# Altium schematic sheet Sheet1.SCHDOC
size 593 x 439 mm; ApprovedBy: ГрибановСВ; CheckedBy: КычкинАВ; Author: СергеевДС; DocumentNumber: ЕМС.02.00.200 Э3; SheetNumber: 1; SheetTotal: 4; DocumentName: Sheet1.SCHDOC
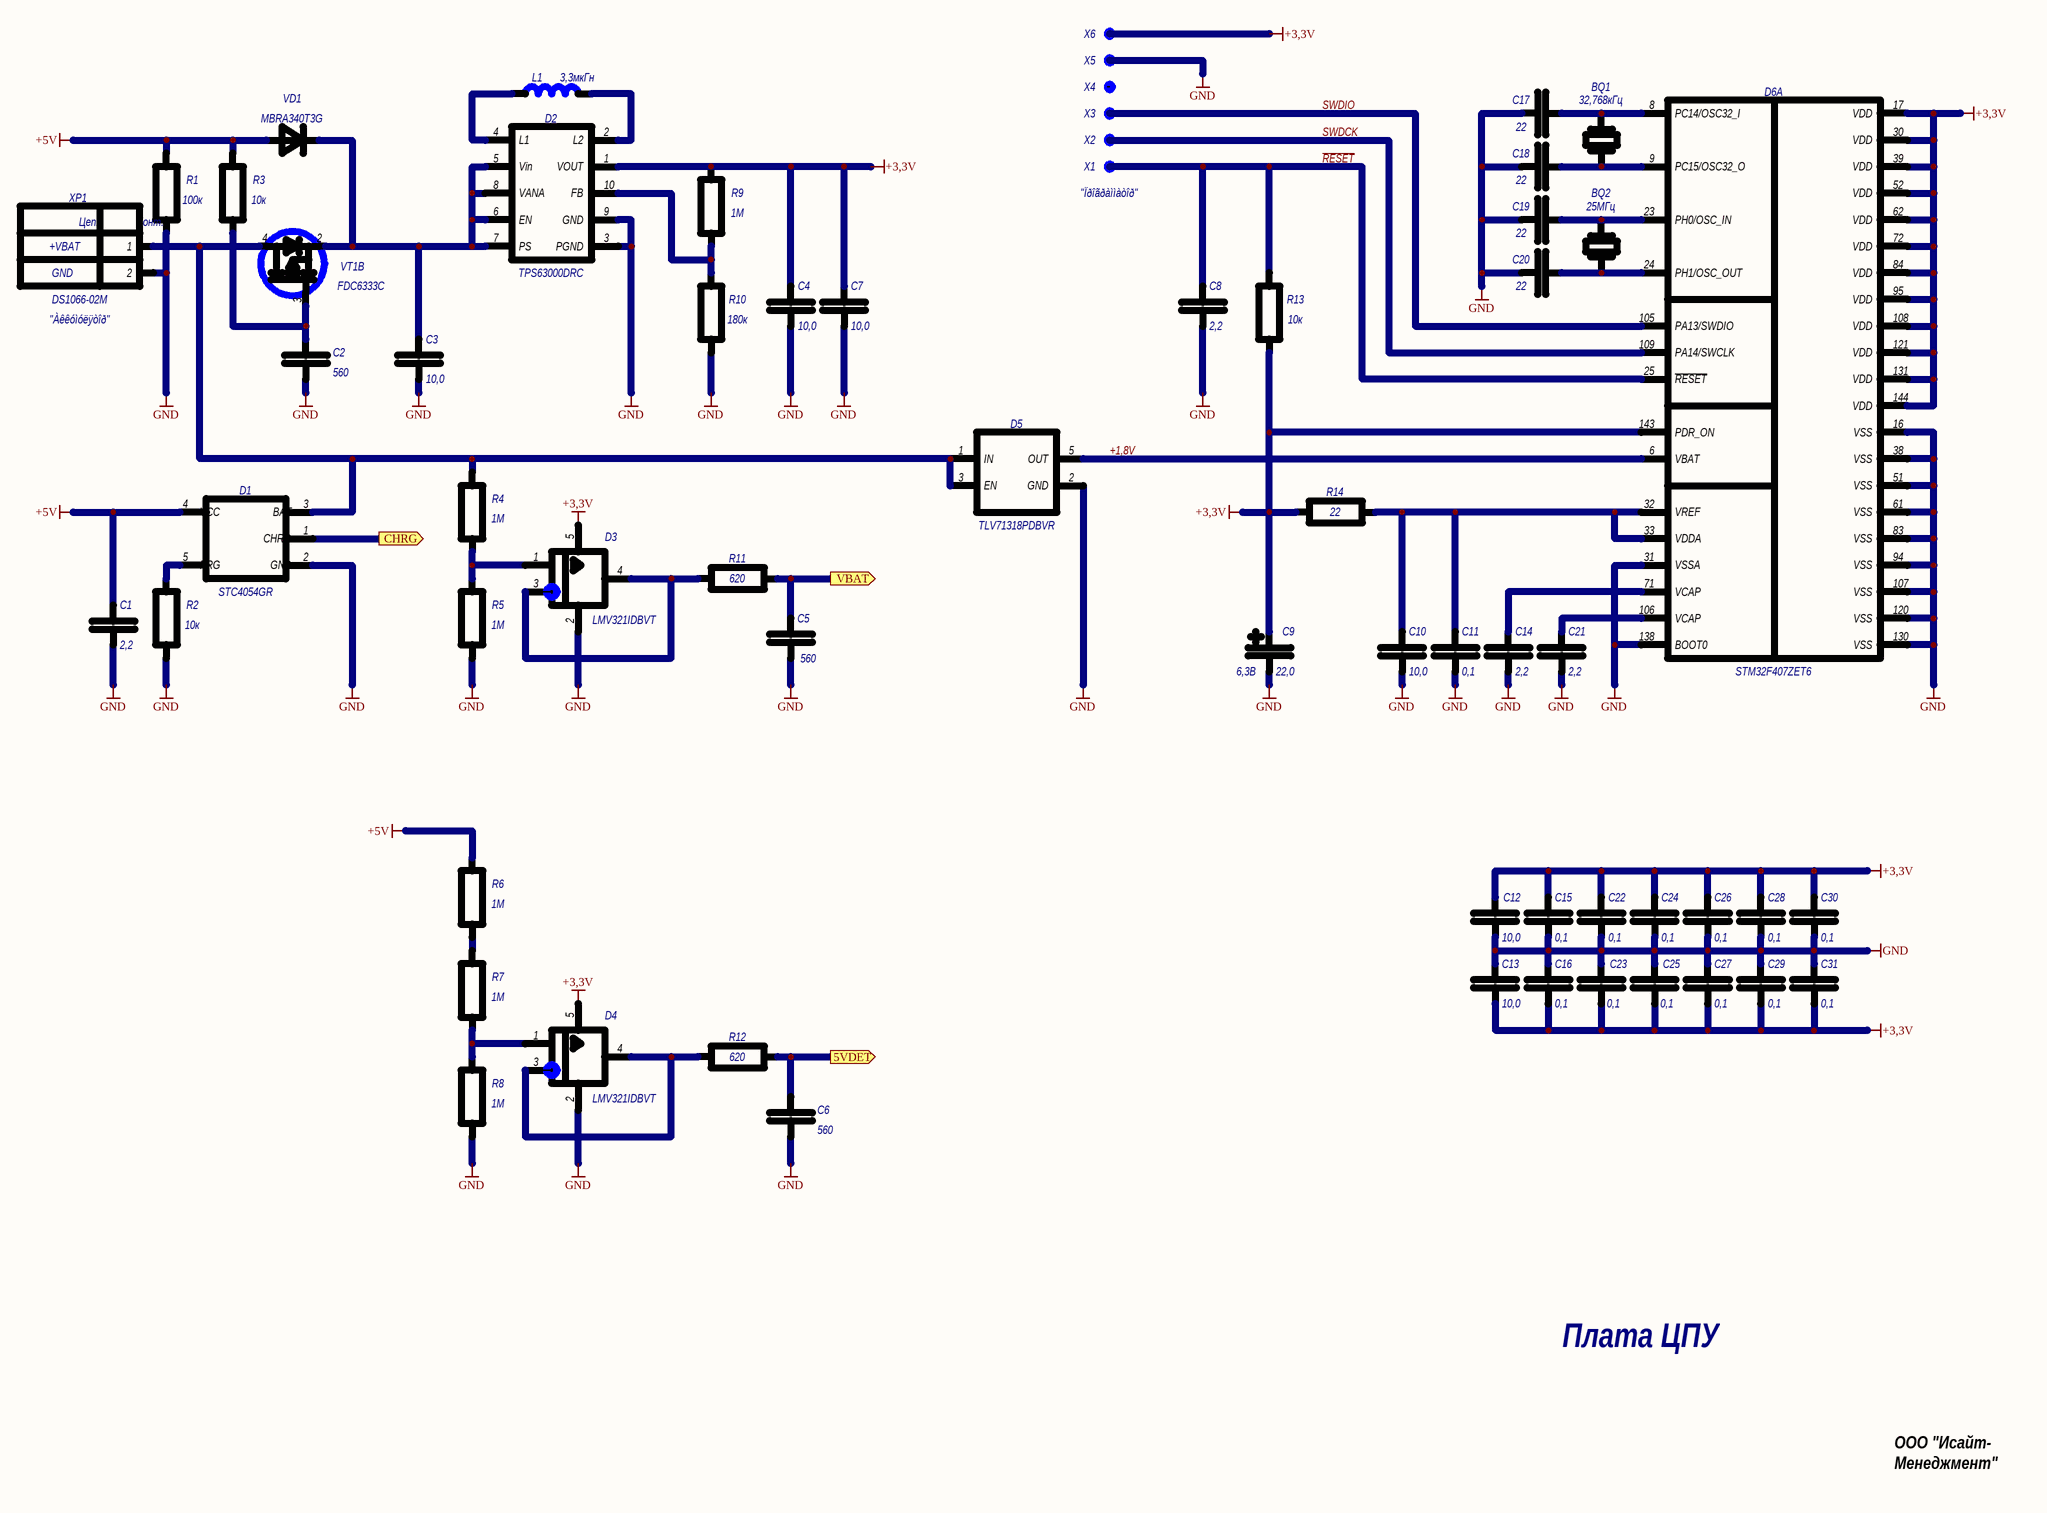
[diagram p0: Sheet1.SCHDOC]

## Parts
BQ1  DT38-32K768  [DT38]  (value not drawn)
BQ2  HC49U-06M  [HC49U]  (value not drawn)
C1  value 2,2  [0805]  (hidden comment: К0805)
C2  value 560  [0805]  (hidden comment: К0805)
C3  value 10,0  [0805]  (hidden comment: К0805)
C4  value 10,0  [0805]  (hidden comment: К0805)
C5  value 560  [0805]  (hidden comment: К0805)
C6  value 560  [0805]  (hidden comment: К0805)
C7  value 10,0  [0805]  (hidden comment: К0805)
C8  value 2,2  [0805]  (hidden comment: К0805)
C9  value 22,0  TG: 6,3В  [TANTAL]  (hidden comment: КТ)
C10  value 10,0  [0805]  (hidden comment: К0805)
C11  value 0,1  [0805]  (hidden comment: К0805)
C12  value 10,0  [0805]  (hidden comment: К0805)
C13  value 10,0  [0805]  (hidden comment: К0805)
C14  value 2,2  [0805]  (hidden comment: К0805)
C15  value 0,1  [0805]  (hidden comment: К0805)
C16  value 0,1  [0805]  (hidden comment: К0805)
C17  value 22  [0805]  (hidden comment: К0805)
C18  value 22  [0805]  (hidden comment: К0805)
C19  value 22  [0805]  (hidden comment: К0805)
C20  value 22  [0805]  (hidden comment: К0805)
C21  value 2,2  [0805]  (hidden comment: К0805)
C22  value 0,1  [0805]  (hidden comment: К0805)
C23  value 0,1  [0805]  (hidden comment: К0805)
C24  value 0,1  [0805]  (hidden comment: К0805)
C25  value 0,1  [0805]  (hidden comment: К0805)
C26  value 0,1  [0805]  (hidden comment: К0805)
C27  value 0,1  [0805]  (hidden comment: К0805)
C28  value 0,1  [0805]  (hidden comment: К0805)
C29  value 0,1  [0805]  (hidden comment: К0805)
C30  value 0,1  [0805]  (hidden comment: К0805)
C31  value 0,1  [0805]  (hidden comment: К0805)
D1  STC4054GR  [SOT-23-5]
D2  TPS63000DRC  [VSON-10]
D3  LMV321IDBVT  [SOT-23-5]
D4  LMV321IDBVT  [SOT-23-5]
D5  TLV71318PDBVR  [SOT-23-5]
D6  STM32F407ZET6  [LQFP-144]  (part A of 4)
L1  SRN3015-101M  [SRN3015]  (value not drawn)
R1  Р0805  [0805]  (value not drawn)
R2  Р0805  [0805]  (value not drawn)
R3  Р0805  [0805]  (value not drawn)
R4  value 1M  [0805]  (hidden comment: Р0805)
R5  value 1M  [0805]  (hidden comment: Р0805)
R6  value 1M  [0805]  (hidden comment: Р0805)
R7  value 1M  [0805]  (hidden comment: Р0805)
R8  value 1M  [0805]  (hidden comment: Р0805)
R9  value 1M  [0805]  (hidden comment: Р0805)
R10  Р0805  [0805]  (value not drawn)
R11  value 620  [0805]  (hidden comment: Р0805)
R12  value 620  [0805]  (hidden comment: Р0805)
R13  Р0805  [0805]  (value not drawn)
R14  value 22  [0805]  (hidden comment: Р0805)
VD1  MBRA340T3G  [SMA]
VT1  FDC6333C  [SOT-23-6]  (part B of 2)
X1  X  [01]  (value not drawn)
X2  X  [01]  (value not drawn)
X3  X  [01]  (value not drawn)
X4  X  [01]  (value not drawn)
X5  X  [01]  (value not drawn)
X6  X  [01]  (value not drawn)
XP1  DS1066-02M  2: GND  1: +VBAT  [DS1066-02M]

## Ports
5VDET (out), CHRG (out), VBAT (out)

## Nets
+3,3V: C4.2 C7.2 C9.1(Plus) C12.1 C13.1 C15.2 C16.1 C22.2 C23.2 C24.2 C25.2 C26.2 C27.1 C28.2 C29.1 C30.2 C31.1 D2.1(VOUT) D3.5(V) D4.5(V) D6.17(VDD) D6.30(VDD) D6.39(VDD) D6.52(VDD) D6.62(VDD) D6.72(VDD) D6.84(VDD) D6.95(VDD) D6.108(VDD) D6.121(VDD) D6.131(VDD) D6.143(PDR_ON) D6.144(VDD) R9.2 R13.1 R14.2 X6.1
+5V: C1.2 D1.4(VCC) R1.2 R3.2 R6.2 VD1.A(Anod)
GND: C1.1 C2.1 C3.1 C4.1 C5.2 C6.1 C7.1 C8.1 C9.2(Minus) C10.1 C11.1 C12.2 C13.2 C14.1 C15.1 C16.2 C17.2 C18.2 C19.2 C20.2 C21.1 C22.1 C23.1 C24.1 C25.1 C26.1 C27.2 C28.1 C29.2 C30.1 C31.2 D1.2(GND) D2.3(PGND) D2.9(GND) D2.11(GND) D3.2(G) D4.2(G) D5.2(GND) D6.16(VSS) D6.31(VSSA) D6.38(VSS) D6.51(VSS) D6.61(VSS) D6.83(VSS) D6.94(VSS) D6.107(VSS) D6.120(VSS) D6.130(VSS) D6.138(BOOT0) R1.1 R2.1 R5.1 R8.1 R10.1 X5.1 XP1.2
5VDET: C6.2 R12.1 ; port 5VDET
+1,8V: D5.5(OUT) D6.6(VBAT)
CHRG: D1.1(CHRG) ; port CHRG
~{RESET}: C8.2 D6.25(~{RESET}) R13.2 X1.1
SWDCK: D6.109(PA14/SWCLK) X2.1
SWDIO: D6.105(PA13/SWDIO) X3.1
VBAT: C5.1 R11.1 ; port VBAT
NetBQ1_1: BQ1.1 C18.1 D6.9(PC15/OSC32_O)
NetBQ1_2: BQ1.2 C17.1 D6.8(PC14/OSC32_I)
NetBQ2_1: BQ2.1 C20.1 D6.24(PH1/OSC_OUT)
NetBQ2_2: BQ2.2 C19.1 D6.23(PH0/OSC_IN)
NetC2_2: C2.2 R3.1 VT1.3(Gate)
NetC3_2: C3.2 D2.5(Vin) D2.6(EN) D2.7(PS) D2.8(VANA) VD1.K(Katod) VT1.2(Source)
NetC10_2: C10.2 C11.2 D6.32(VREF) D6.33(VDDA) R14.1
NetC14_2: C14.2 D6.71(VCAP)
NetC21_2: C21.2 D6.106(VCAP)
NetD1_3: D1.3(BAT) D5.1(IN) D5.3(EN) R4.2 VT1.4(Drain) XP1.1
NetD1_5: D1.5(PRG) R2.2
NetD2_2: D2.2(L2) L1.2
NetD2_4: D2.4(L1) L1.1
NetD2_10: D2.10(FB) R9.1 R10.2
NetD3_1: D3.1(+IN) R4.1 R5.2
NetD3_3: D3.3(-IN) D3.4(OUT) R11.2
NetD4_1: D4.1(+IN) R7.2 R8.2
NetD4_3: D4.3(-IN) D4.4(OUT) R12.2
NetR6_1: R6.1 R7.1

Not connected (* = marked no-connect by the designer): D5 4; D6 49; X4 1

## Notes on the sheet
- (near X1) "Ïðîãðàììàòîð"
- (near XP1) "Àêêóìóëÿòîð"
- Плата ЦПУ
- ООО "Исайт-
  Менеджмент"
- Перв. примен.
- Справ. №
- Подп. и дата
- Инв. № дубл.
- Взам. инв. №
- Изм.
- Лист
- № докум.
- Подп.
- Дата
- Литера
- Масса
- Масштаб
- Пров.
- Разраб.
- О
- 1
- _
- Инв. № подл.
- Н.контр.
- Схема электрическая
  принципиальная
- Листов
- Утв.
- (in symbol DS1066-02M) Цепь; Конт.
- (in symbol DT38-32K768) 32,768кГц
- (in symbol HC49U-06M) 25МГц
- (in symbol SRN3015-101M) 3,3мкГн
- (in symbol Р0805) 100к; 10к; 180к

## Library data of the parts
BQ1 = DT38-32K768: РЕЗОНАТОР; TG: {TG}; TO: 020, 180/3x8/ASC327; TU: {TU}; NO: 0522; RefDes2: {RefDes2}; ComponentHeight: {ComponentHeight}
BQ2 = HC49U-06M: РЕЗОНАТОР; TG: {TG}; TO: 020, 211/-/6.000; TU: {TU}; NO: 2491; RefDes2: {RefDes2}; ComponentHeight: {ComponentHeight}
C1-C8 C10-C31 = К0805: КОНДЕНСАТОР; TG: NP0; TO: 5%; TU: {TU}; NO: {NO}; RefDes2: {RefDes2}; ComponentHeight: 1
C9 = КТ: КОНДЕНСАТОР; TU: {TU}; TO: {TO}; NO: {NO}; RefDes2: {RefDes2}; ComponentHeight: {ComponentHeight}
D1 = STC4054GR: {Description}; NO: {NO}; TG: {TG}; TO: {TO}; TU: {TU}; RefDes2: {RefDes2}; ComponentHeight: {ComponentHeight}
D2 = TPS63000DRC: {Description}; TU: {TU}; TG: {TG}; TO: {TO}; NO: {NO}; ComponentHeight: {ComponentHeight}
D3 D4 = LMV321IDBVT: {Description}; TU: {TU}; TG: {TG}; TO: {TO}; NO: {NO}; RefDes2: {RefDes2}; ComponentHeight: {ComponentHeight}
D5 = TLV71318PDBVR: {Description}; NO: {NO}; TG: {TG}; TO: {TO}; TU: {TU}; RefDes2: {RefDes2}; ComponentHeight: {ComponentHeight}
L1 = SRN3015-101M: {Description}; TU: {TU}; TO: {TO}; TG: {TG}; NO: {NO}; RefDes2: {RefDes2}; ComponentHeight: {ComponentHeight}
R1-R14 = Р0805: РЕЗИСТОР; TG: 0,125; TO: 1%; TU: {TU}; NO: {NO}; RefDes2: {RefDes2}; ComponentHeight: 1
VD1 = MBRA340T3G: {Description}; TU: {TU}; TG: {TG}; RefDes2: {RefDes2}; TO: {TO}; NO: {NO}; ComponentHeight: {ComponentHeight}
VT1 = FDC6333C: {Description}; TO: {TO}; TU: {TU}; NO: {NO}; RefDes2: {RefDes2}; TG: {TG}; ComponentHeight: {ComponentHeight}
X1-X6 = X: КОНТАКТ; TG: {TG}; TO: {TO}; TU: {TU}; NO: {NO}; RefDes2: {RefDes2}; ComponentHeight: 0.1
XP1 = DS1066-02M: {Description}; TU: {TU}; TG: {TG}; RefDes2: {RefDes2}; TO: {TO}; NO: {NO}; ComponentHeight: {ComponentHeight}